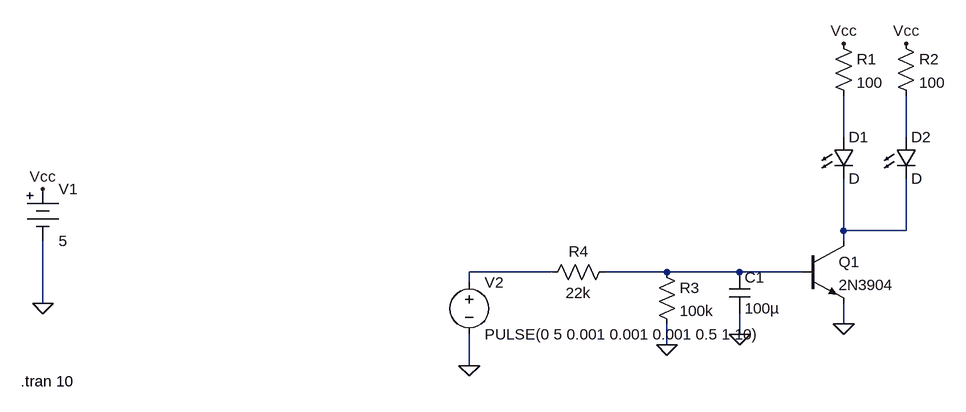
[diagram p0: schematic fading_led.asc]
fading_led.asc, the LTspice schematic file:
Version 4
SHEET 1 880 680
WIRE 320 -16 320 -80
WIRE 416 -16 416 -80
WIRE 320 128 320 48
WIRE 416 128 416 48
WIRE 416 128 320 128
WIRE 320 144 320 128
WIRE -128 192 -256 192
WIRE 48 192 -48 192
WIRE 160 192 48 192
WIRE 256 192 160 192
WIRE -256 208 -256 192
WIRE -912 240 -912 144
WIRE 320 272 320 240
WIRE 160 288 160 256
WIRE 48 304 48 272
WIRE -256 336 -256 288
FLAG 320 272 0
FLAG 160 288 0
FLAG 48 304 0
FLAG -912 240 0
FLAG -912 64 Vcc
FLAG 416 -160 Vcc
FLAG 320 -160 Vcc
FLAG -256 336 0
SYMBOL npn2 256 144 R0
SYMATTR InstName Q1
SYMATTR Value 2N3904
SYMBOL res 304 -176 R0
SYMATTR InstName R1
SYMATTR Value 100
SYMBOL res 400 -176 R0
SYMATTR InstName R2
SYMATTR Value 100
SYMBOL LED 304 -16 R0
SYMATTR InstName D1
SYMBOL LED 400 -16 R0
SYMATTR InstName D2
SYMBOL cap 144 192 R0
SYMATTR InstName C1
SYMATTR Value 100µ
SYMBOL res 32 176 R0
SYMATTR InstName R3
SYMATTR Value 100k
SYMBOL res -32 176 R90
WINDOW 0 0 56 VBottom 2
WINDOW 3 32 56 VTop 2
SYMATTR InstName R4
SYMATTR Value 22k
SYMBOL Misc\\battery -912 48 R0
WINDOW 123 0 0 Left 0
WINDOW 39 0 0 Left 0
SYMATTR InstName V1
SYMATTR Value 5
SYMBOL voltage -256 192 R0
WINDOW 123 0 0 Left 0
WINDOW 39 0 0 Left 0
SYMATTR InstName V2
SYMATTR Value PULSE(0 5 0.001 0.001 0.001 0.5 1 10)
TEXT -946 360 Left 2 !.tran 10

The netlist it stands for:
* fading_led.asc
Q1 N003 N005 0 0 2N3904
R1 Vcc N001 100
R2 Vcc N002 100
D1 N001 N003 D
D2 N002 N003 D
C1 N005 0 100µ
R3 N005 0 100k
R4 N005 N004 22k
V1 Vcc 0 5
V2 N004 0 PULSE(0 5 0.001 0.001 0.001 0.5 1 10)
.model D D
.lib standard.dio
.model NPN NPN
.model PNP PNP
.lib standard.bjt
.tran 10
.backanno
.end